# EAGLE design Supplemental Power Switch System (EAGLE 8.1.0)
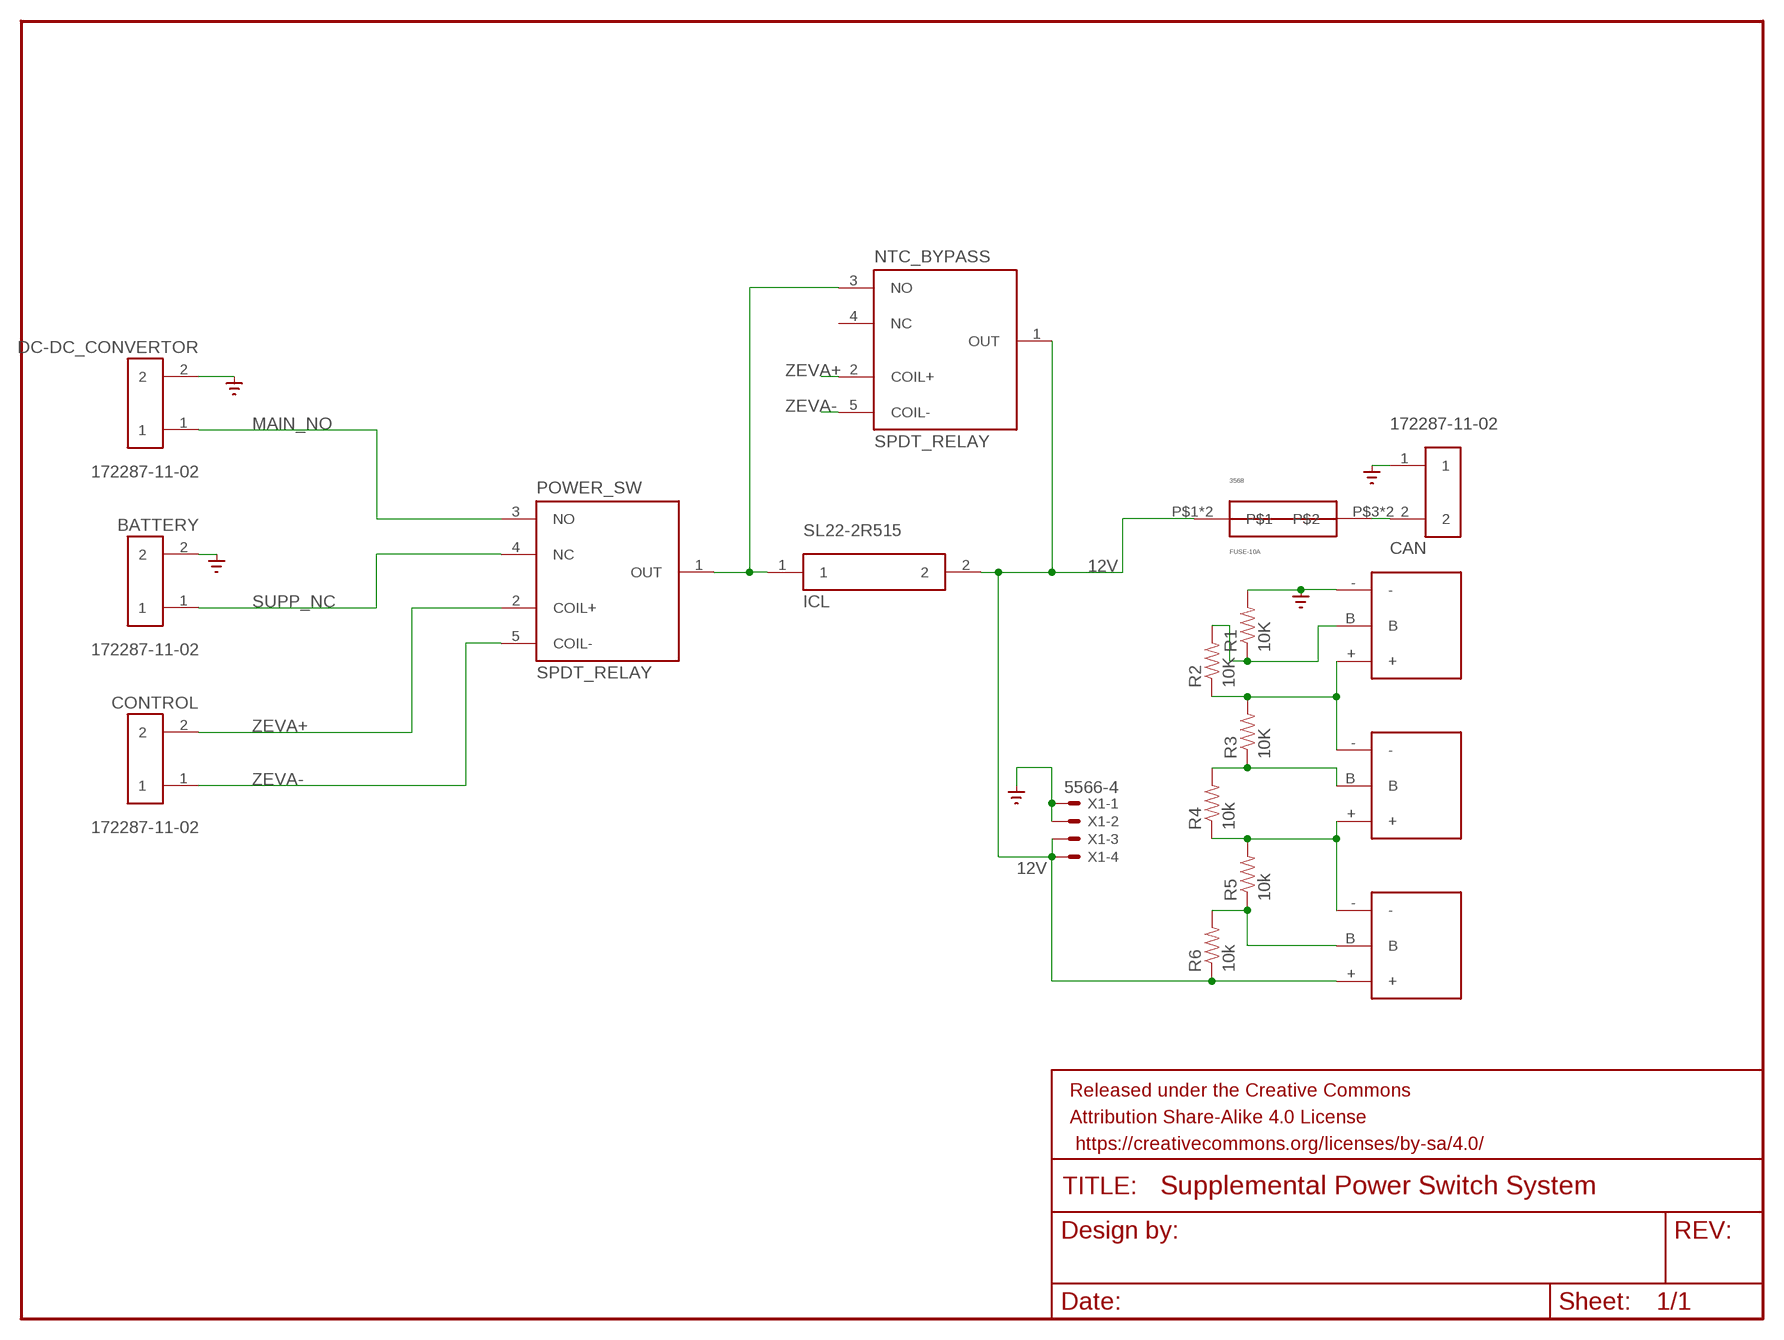
[diagram p0: schematic, sheet 1]

## Parts
BATTERY  172287-11-02  [172287-ULTRA-FIT]
C1  SUPER-CAPACITOR  [DMF]
C2  SUPER-CAPACITOR  [DMF]
C3  SUPER-CAPACITOR  [DMF]
CAN  172287-11-02  [172287-ULTRA-FIT]
CONTROL  172287-11-02  [172287-ULTRA-FIT]
DC-DC_CONVERTOR  172287-11-02  [172287-ULTRA-FIT]
FRAME1  FRAME-LETTERNO_PACKAGE  [DUMMY]
FUSE-10A  3568  [3568-MINI-297]
ICL  SL22-2R515  [SL22-2R515]
NTC_BYPASS  SPDT_RELAY  [G8QN-1C4]
POWER_SW  SPDT_RELAY  [G8QN-1C4]
R1  10K  RESISTORPTH-1/6W  [1/6W-RES]
R2  10K  RESISTORPTH-1/6W  [1/6W-RES]
R3  10K  RESISTORPTH-1/6W  [1/6W-RES]
R4  10k  RESISTORPTH-1/6W  [1/6W-RES]
R5  10k  RESISTORPTH-1/6W  [1/6W-RES]
R6  10k  RESISTORPTH-1/6W  [1/6W-RES]
X1  5566-4  [5566-4]

## Nets
12V: C3.+ FUSE-10A.P$1 FUSE-10A.P$2 ICL.2 NTC_BYPASS.1(OUT) R6.1 X1.3 X1.4
GND: BATTERY.2 C1.- CAN.1 DC-DC_CONVERTOR.2 R1.2 X1.1 X1.2 ; supply symbol labelled GND_
MAIN_NO: DC-DC_CONVERTOR.1 POWER_SW.3(NO)
N$1: CAN.2 FUSE-10A.P$3 FUSE-10A.P$4
N$3: C3.B R5.1 R6.2
N$4: C2.+ C3.- R4.1 R5.2
N$5: C2.B R3.1 R4.2
N$6: C1.+ C2.- R2.1 R3.2
N$7: C1.B R1.1 R2.2
N$8: ICL.1 NTC_BYPASS.3(NO) POWER_SW.1(OUT)
SUPP_NC: BATTERY.1 POWER_SW.4(NC)
ZEVA+: CONTROL.2 NTC_BYPASS.2(COIL+) POWER_SW.2(COIL+)
ZEVA-: CONTROL.1 NTC_BYPASS.5(COIL-) POWER_SW.5(COIL-)
Unconnected: NTC_BYPASS.4(NC)

## Library data of the parts
BATTERY CAN CONTROL DC-DC_CONVERTOR = Hooman:172287-11-02: Ultra-Fit™ 172287 Header Molex 3.5 mm pitch 2 pin connector header
C1-C3 = Hooman:SUPER-CAPACITOR: Murata Super Capacitor DMF3Z5R5H474M3DTA0
FRAME1 = SparkFun-Aesthetics:FRAME-LETTER: Schematic Frame Standard 8.5x11 US Letter frame; DESIGNER: Nobody; VERSION: v01
FUSE-10A = Hooman:3568: MINI 296 fuse holder for MINI BLADE fuse https://www.digikey.ca/products/en?FV=ffec3ba1,ffe0008c
ICL = Hooman:SL22-2R515: NTC Ametherm Inrush Current Limiter
NTC_BYPASS POWER_SW = Hooman:SPDT_RELAY: SPDT Relay
R1-R6 = SparkFun-Resistors:RESISTOR: Resistor Basic schematic elements and footprints for 0603, 1206, and PTH resistors.
X1 = con-molex:5566-4: Mini FIT connector 4 pol Source: http://www.molex.com; OC_FARNELL: unknown; OC_NEWARK: unknown

## Board
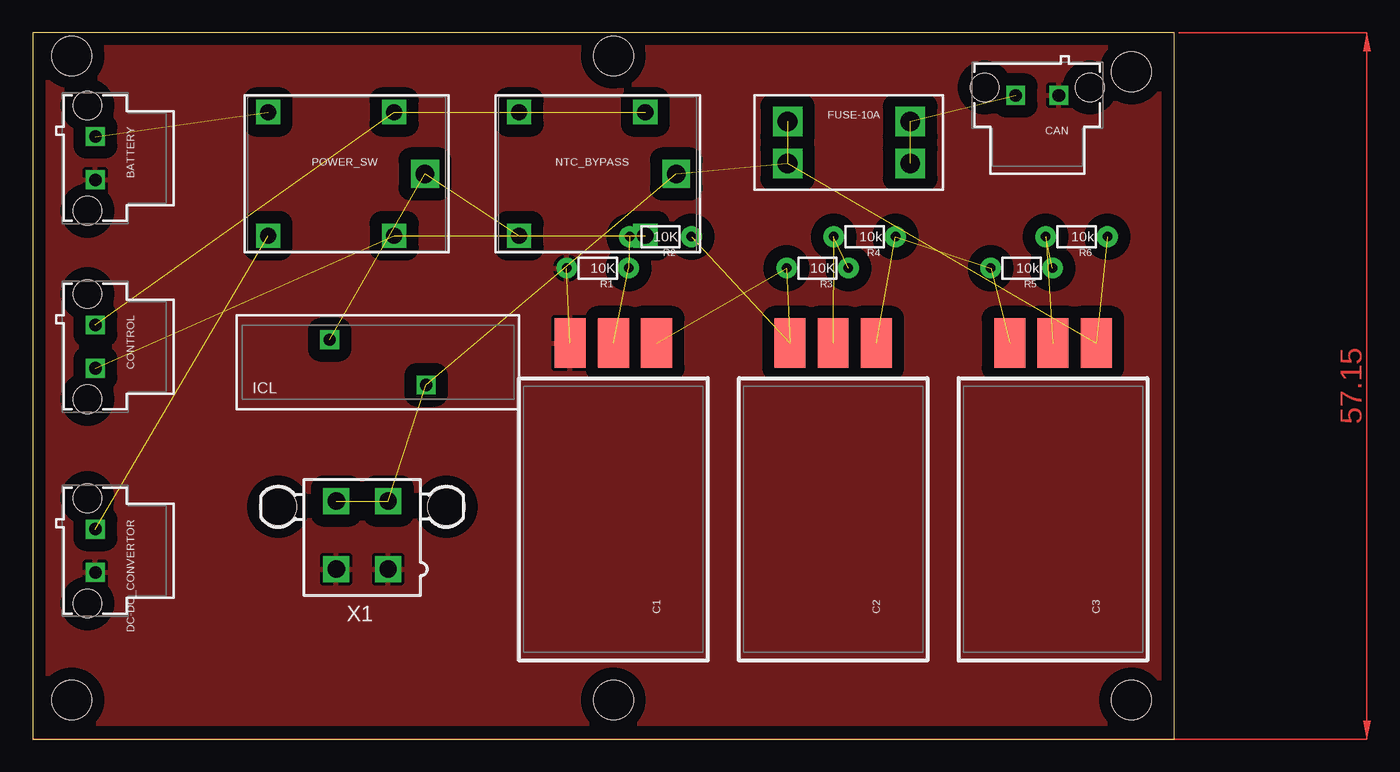
[diagram p1: board, top side]

Size 92.38 x 57.14 mm. Coordinates in mm from the lower left corner, seen from the top.
Outline: 0,0 92.38,0 92.38,57.14 0,57.14 0,0
Copper layers (1*16): Top 0.035mm / dielectric 1.5mm / Bottom 0.035mm
Design rules "default": minimum track width 10mil, minimum drill 24mil, track to track 8mil, track to pad 8mil, pad to pad 8mil, via to via 8mil, smd to smd 8mil, copper to edge 40mil, drill to drill 8mil, minimum pad ring 10mil, minimum via ring 8mil, stop-mask expansion 4mil, vias tented up to drill 0mil, thermal gap 10mil
Holes 3.2 mm at 3.17,3.17 46.99,3.17 46.99,55.24 3.17,55.24 88.9,53.98 88.9,3.17

### Footprints (pad centres in the part's own frame; a part is rotated, then mirrored left to right if it is on the bottom)
172287-ULTRA-FIT = drill 1.02 square: 1 -1.75,0; 2 1.75,0 | hole 2.3: -4.25,-0.63; 4.25,-0.63
DMF = smd 4 x 2.5: + 14.25,-3.5; - 14.25,3.5; B 14.25,0
3568-MINI-297 = drill 1.6 square: P$1 4.96,1.7; P$2 4.96,-1.7; P$3 -4.96,1.7; P$4 -4.96,-1.7
SL22-2R515 = drill 1 square: 1 -3.9,1.825; 2 3.9,-1.825
G8QN-1C4 = drill 1.5 square: 1 -6.35,0 | drill 1.3 square: 2 -3.85,5; 3 6.35,5; 4 6.35,-5; 5 -3.85,-5
1/6W-RES = drill 0.762 pad 1.676: 1 -2.5,0; 2 2.5,0
5566-4 = drill 1.4 square: 1 2.1,-2.75; 2 -2.1,-2.75; 3 2.1,2.75; 4 -2.1,2.75 | hole 3: 6.8,2.29; -6.8,2.29

### Placement (x,y rotation side)
BATTERY  5.08,46.99 270 top
C1  46.99,17.78 90 top
C2  64.77,17.78 90 top
C3  82.55,17.78 90 top
CAN  81.28,52.07 180 top
CONTROL  5.08,31.75 270 top
DC-DC_CONVERTOR  5.08,15.24 270 top
FRAME1  -13.97,15.24 0 top  (outside the outline)
FUSE-10A  66.04,48.26 180 top
ICL  27.94,30.48 0 top
NTC_BYPASS  45.72,45.72 180 top
POWER_SW  25.4,45.72 180 top
R1  45.72,38.1 180 top
R2  50.8,40.64 180 top
R3  63.5,38.1 180 top
R4  67.31,40.64 180 top
R5  80.01,38.1 180 top
R6  84.45,40.64 180 top
X1  26.67,16.51 0 top

### Tracks (layer width: path | path; a pad name or v marks a point on that pad's centre or on a via)
12V  (7 unrouted)
GND  (1 unrouted)
  pour Top (isolate 1.016): 0,57.15 92.71,57.15 92.71,0 0,0
MAIN_NO  (1 unrouted)
N$1  (2 unrouted)
N$3  (2 unrouted)
N$4  (3 unrouted)
N$5  (2 unrouted)
N$6  (3 unrouted)
N$7  (2 unrouted)
N$8  (2 unrouted)
SUPP_NC  (1 unrouted)
ZEVA+  (2 unrouted)
ZEVA-  (2 unrouted)
(copper drawn outside any net)
  shapes: Top area x2